# EAGLE design board1 (EAGLE 7.3.0)
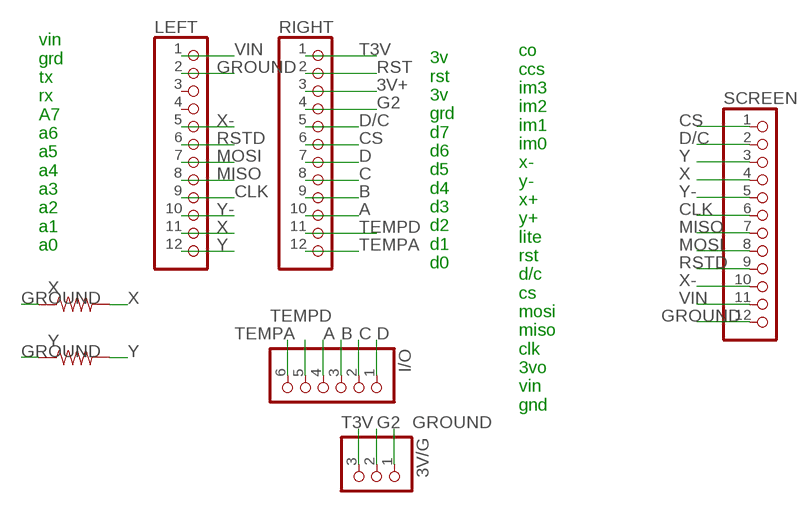
[diagram p0: schematic, sheet 1]

## Parts
3V/G  PINHD-1X3CB  [1X03-CLEANBIG]
I/O  PINHD-1X6CB  [1X06-CLEANBIG]
LEFT  PINHD-1X12-CB  [1X12-CB]
RIGHT  PINHD-1X12-CB  [1X12-CB]
SCREEN  PINHD-1X12-CB  [1X12-CB]
X  10KOHM-1/6W-5%(PTH)KIT  [AXIAL-0.3-KIT]
Y  10KOHM-1/6W-5%(PTH)KIT  [AXIAL-0.3-KIT]

## Nets
3V+: RIGHT.3
A: I/O.4 RIGHT.10
B: I/O.3 RIGHT.9
C: I/O.2 RIGHT.8
CLK: LEFT.9 SCREEN.6
CS: RIGHT.6 SCREEN.1
D: I/O.1 RIGHT.7
D/C: RIGHT.5 SCREEN.2
G2: 3V/G.2 RIGHT.4
GROUND: 3V/G.1 LEFT.2 SCREEN.12 X.P$1 Y.P$1
MISO: LEFT.8 SCREEN.7
MOSI: LEFT.7 SCREEN.8
RST: RIGHT.2
RSTD: LEFT.6 SCREEN.9
T3V: 3V/G.3 RIGHT.1
TEMPA: I/O.6 RIGHT.12
TEMPD: I/O.5 RIGHT.11
VIN: LEFT.1 SCREEN.11
X: LEFT.11 SCREEN.4 X.P$2
X-: LEFT.5 SCREEN.10
Y: LEFT.12 SCREEN.3 Y.P$2
Y-: LEFT.10 SCREEN.5
Unconnected: LEFT.3 LEFT.4

## Notes on the sheet
- vin
  grd
  tx
  rx
  A7
  a6
  a5
  a4
  a3
  a2
  a1
  a0
- 3v
  rst
  3v
  grd
  d7
  d6
  d5
  d4
  d3
  d2
  d1
  d0
- co
  ccs
  im3
  im2
  im1
  im0
  x-
  y-
  x+
  y+
  lite
  rst
  d/c
  cs
  mosi
  miso
  clk
  3vo
  vin
  gnd

## Library data of the parts
3V/G = adafruit:PINHD-1X3: PIN HEADER
I/O = adafruit:PINHD-1X6: PIN HEADER
LEFT RIGHT SCREEN = adafruit:PINHD-1X12: PIN HEADER
X Y = SparkFun-Resistors:10KOHM-1/6W-5%(PTH): RES-08375; PROD_ID: RES-08375

## Board
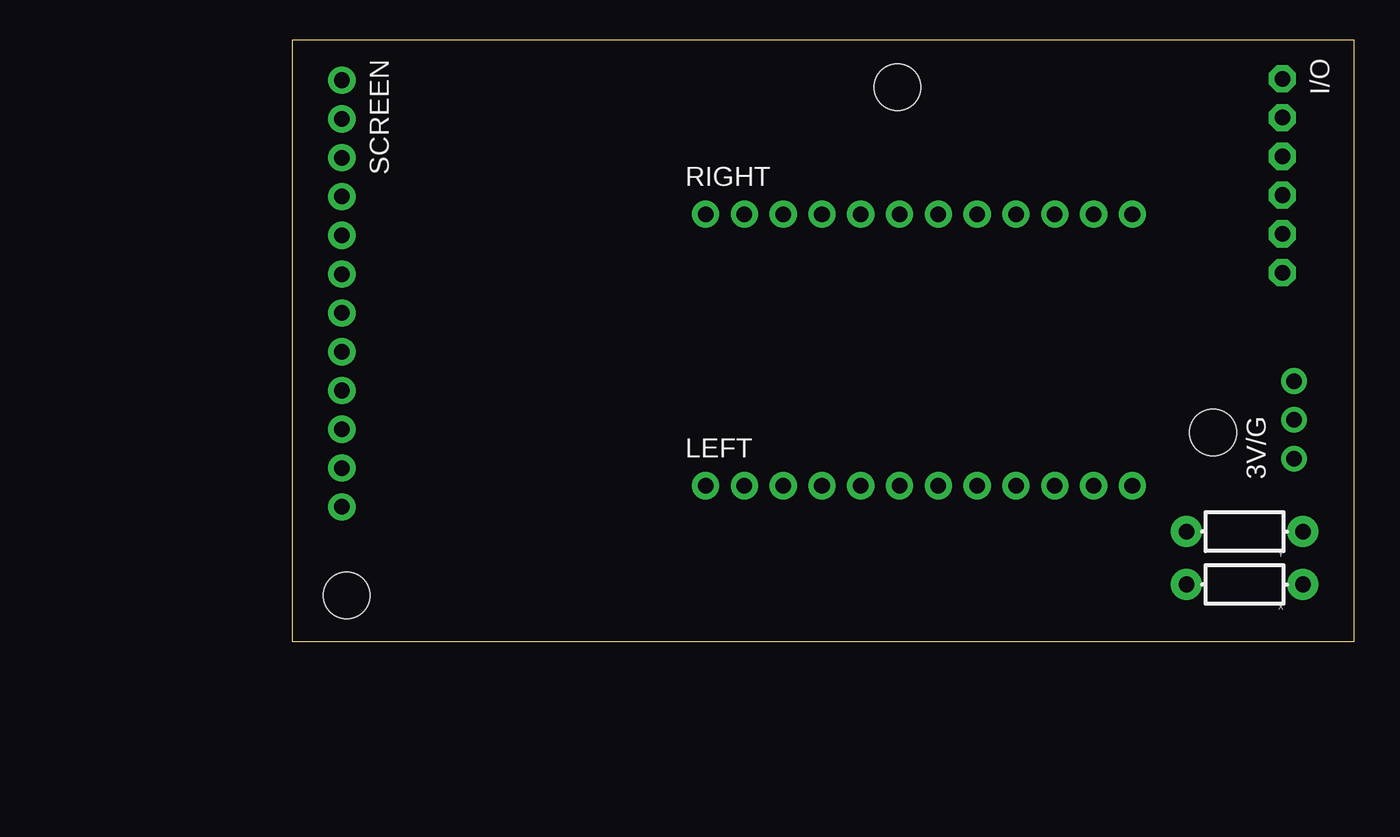
[diagram p1: board, top side]
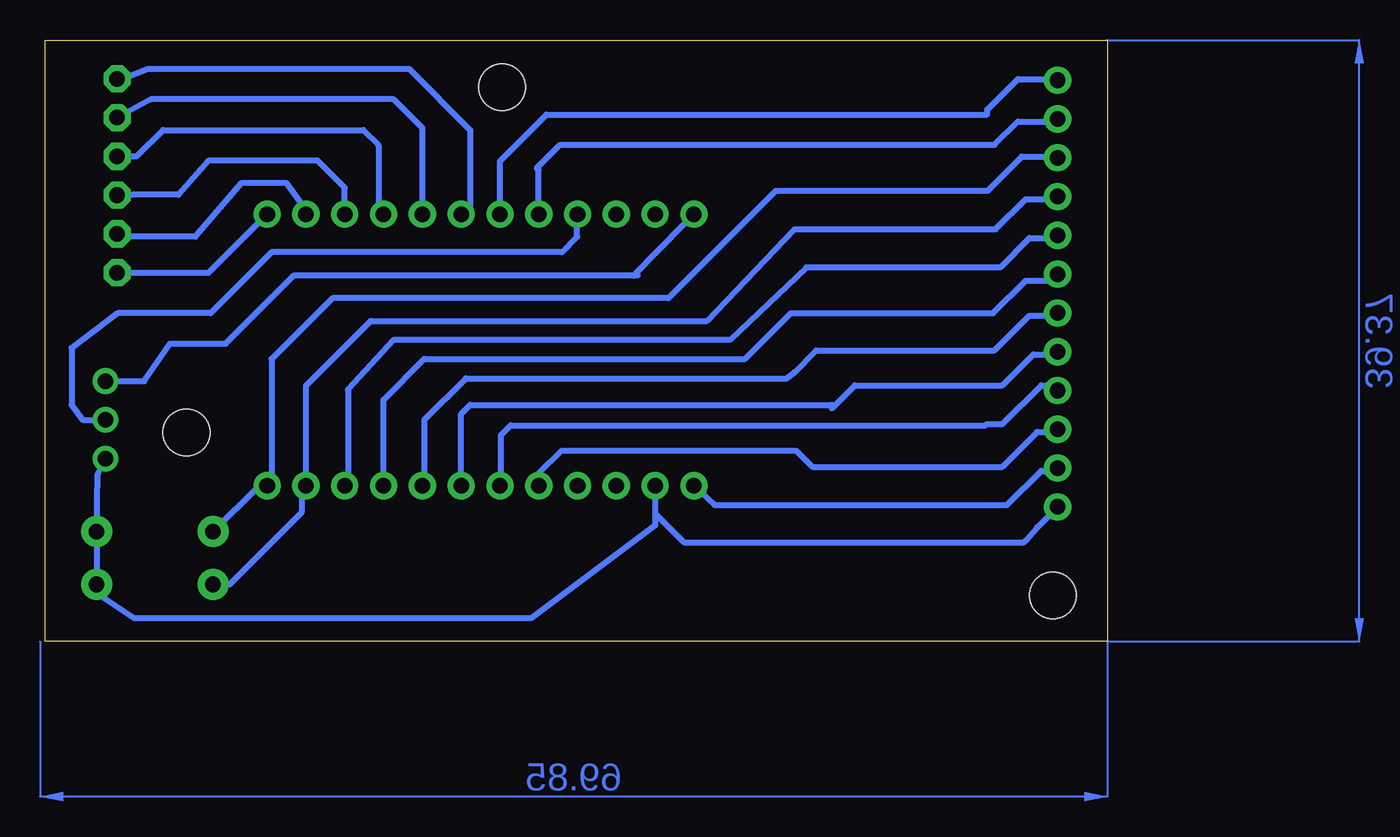
[diagram p2: board, bottom side, seen from below]

Size 69.52 x 39.36 mm. Coordinates in mm from the lower left corner, seen from the top.
Outline: 0,0 69.52,0 69.52,39.36 0,39.36 0,0
Copper layers (1*16): Top 0.035mm / dielectric 1.5mm / Bottom 0.035mm
Design rules "Othermill-DRC-1-32": minimum track width 8mil, minimum drill 0.8mm, track to track 0.794003125mm, track to pad 0.794003125mm, pad to pad 0.794003125mm, via to via 0.794003125mm, smd to smd 0mil, copper to edge 0mil, drill to drill 1mil, minimum pad ring 10mil, minimum via ring 10mil, stop-mask expansion 1mil, vias tented up to drill 30mil, thermal gap 10mil

### Footprints (pad centres in the part's own frame; a part is rotated, then mirrored left to right if it is on the bottom)
1X03-CLEANBIG = drill 1.016 pad 1.676: 1 -2.54,0; 2 0,0; 3 2.54,0
1X06-CLEANBIG = drill 1.016 pad 1.778 octagon: 1 -6.35,0; 2 -3.81,0; 3 -1.27,0; 4 1.27,0; 5 3.81,0; 6 6.35,0
1X12-CB = drill 1.016 pad 1.778: 1 -13.97,0; 2 -11.43,0; 3 -8.89,0; 4 -6.35,0; 5 -3.81,0; 6 -1.27,0; 7 1.27,0; 8 3.81,0; 9 6.35,0; 10 8.89,0; 11 11.43,0; 12 13.97,0
STAND-OFF-TIGHT = hole 3.048: 0,0
AXIAL-0.3-KIT = drill 1.016 pad 2.032: P$1 -3.81,0; P$2 3.81,0

### Placement (x,y rotation side)
3V/G  65.57,14.51 90 top
I/O  64.81,30.49 270 top
LEFT  41.02,10.19 0 top
RIGHT  41.02,27.97 0 top
SCREEN  3.24,22.78 270 top
U$1  [STAND-OFF-TIGHT]  3.56,3 0 top
U$2  [STAND-OFF-TIGHT]  39.61,36.28 90 top
U$3  [STAND-OFF-TIGHT]  60.28,13.67 0 top
X  62.34,3.73 180 top
Y  62.34,7.19 180 top

### Tracks (layer width: path | path; a pad name or v marks a point on that pad's centre or on a via)
A
  Bottom 0.406: RIGHT.10 49.91,29.7 51.7,31.49 58.81,31.49 60.79,29.25 63.83,29.25 I/O.4
B
  Bottom 0.406: I/O.3 63.54,31.76 61.81,33.49 48.7,33.49 47.7,32.49 47.7,28.3 RIGHT.9
C
  Bottom 0.406: RIGHT.8 44.83,33.62 46.7,35.49 62.62,35.49 I/O.2
CLK
  Bottom 0.406: LEFT.9 47.37,15.82 44.7,18.49 23.7,18.49 20.7,21.49 7.46,21.49 5.33,23.62 3.66,23.62 SCREEN.6
CS
  Bottom 0.406: RIGHT.6 39.75,31.44 36.7,34.49 7.84,34.49 7.84,34.83 5.84,36.83 3.32,36.83 SCREEN.1
D
  Bottom 0.406: I/O.1 64.46,36.84 62.81,37.49 45.7,37.49 41.7,33.49 41.7,28.56 RIGHT.7
D/C
  Bottom 0.406: RIGHT.5 37.21,30.86 37.34,30.99 35.81,32.51 7.37,32.51 5.84,34.04 3.41,34.04 SCREEN.2
G2
  Bottom 0.406: 3V/G.2 67.06,14.51 67.79,15.49 67.79,19.22 64.76,21.49 58.7,21.49 54.7,25.49 35.7,25.49 34.7,26.49 34.7,27.94 RIGHT.4
GROUND
  Bottom 0.406: 3V/G.1 66.08,10.95 Y.P$1 X.P$1 66.39,3.49 66.7,3.49 63.7,1.51 37.72,1.51 29.59,7.6 29.59,8.38 | LEFT.2 29.59,8.38 | 29.59,8.38 27.7,6.49 5.45,6.49 5.33,6.6 4.57,7.47 SCREEN.12
MISO
  Bottom 0.406: LEFT.8 44.7,10.32 44.7,14.49 41.97,17.22 20.99,17.22 20.48,17.62 19.05,19.05 7.37,19.05 5.08,21.34 3.41,21.34 SCREEN.7
MOSI
  Bottom 0.406: LEFT.7 42.29,14.9 41.7,15.49 18.02,15.49 18.02,15.26 16.51,16.76 6.86,16.76 4.83,18.8 3.41,18.8 SCREEN.8
RSTD
  Bottom 0.406: LEFT.6 39.7,10.24 39.7,13.49 39.05,14.14 7.96,14.14 7.87,14.22 6.86,14.22 4.32,16.76 3.57,16.76 SCREEN.9
T3V
  Bottom 0.406: 27.22,27.97 RIGHT.1 27.7,27.32 31,23.95 30.72,23.98 53.21,23.98 57.7,19.49 61.35,19.49 63.03,17.05 3V/G.3
TEMPA
  Bottom 0.406: I/O.6 58.82,24.14 RIGHT.12
TEMPD
  Bottom 0.406: RIGHT.11 52.45,28.24 53.7,30 56.7,30 59.7,26.49 64.62,26.49 I/O.5
VIN
  Bottom 0.406: LEFT.1 25.7,8.92 6.57,8.92 4.32,11.18 3.41,11.18 SCREEN.11
X
  Bottom 0.406: X.P$2 57.46,3.73 52.7,8.49 52.7,9.94 LEFT.11 52.45,16.74 48.21,20.98 26.21,20.98 20.46,26.98 7.31,26.98 5.33,28.96 3.41,28.96 SCREEN.4
X-
  Bottom 0.406: LEFT.5 37.21,10.98 35.7,12.49 20.37,12.49 19.3,11.43 6.86,11.43 4.57,13.72 3.41,13.72 SCREEN.10
Y
  Bottom 0.406: Y.P$2 55.53,10.19 LEFT.12 54.7,10.48 54.7,18.49 50.72,22.48 28.72,22.48 21.7,29.49 7.85,29.49 5.59,31.75 3.32,31.75 SCREEN.3
Y-
  Bottom 0.406: LEFT.10 49.7,10.4 49.7,16.49 46.7,19.75 24.7,19.75 19.7,24.49 7,24.49 5.08,26.42 3.41,26.42 SCREEN.5
(copper drawn outside any net)
  shapes: Bottom area x2